# Altium schematic sheet mainboard-schematic.schdoc
size 298 x 132 mm
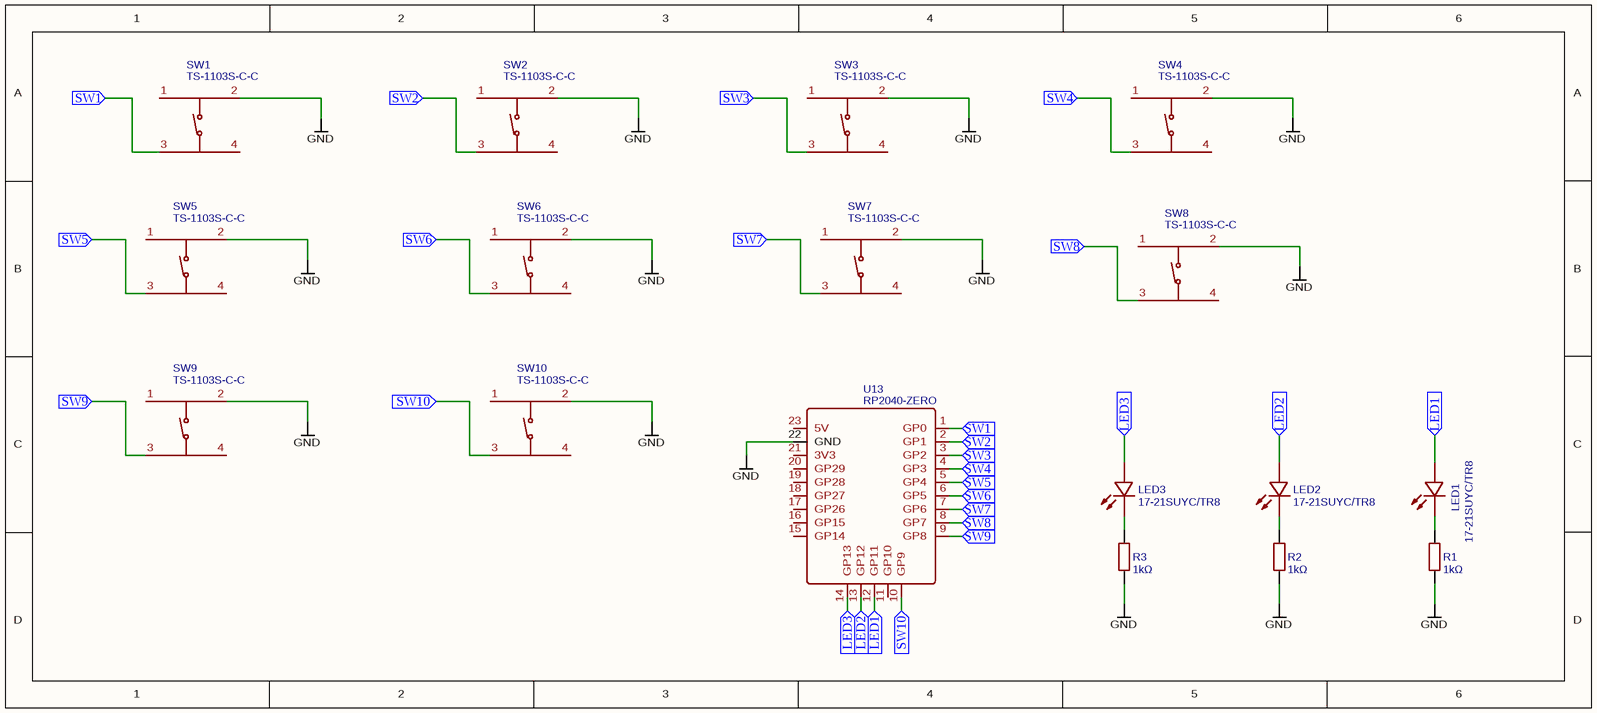
[diagram p0: mainboard-schematic.schdoc]

## Parts
LED1  17-21SUYC/TR8  [LED0805-R-RD]
LED2  17-21SUYC/TR8  [LED0805-R-RD]
LED3  17-21SUYC/TR8  [LED0805-R-RD]
R1  1kΩ  [R1206]
R2  1kΩ  [R1206]
R3  1kΩ  [R1206]
SW1  TS-1103S-C-C  [KEY-SMD_4P-L12.0-W12.0-P5.00-LS15.4]
SW2  TS-1103S-C-C  [KEY-SMD_4P-L12.0-W12.0-P5.00-LS15.4]
SW3  TS-1103S-C-C  [KEY-SMD_4P-L12.0-W12.0-P5.00-LS15.4]
SW4  TS-1103S-C-C  [KEY-SMD_4P-L12.0-W12.0-P5.00-LS15.4]
SW5  TS-1103S-C-C  [KEY-SMD_4P-L12.0-W12.0-P5.00-LS15.4]
SW6  TS-1103S-C-C  [KEY-SMD_4P-L12.0-W12.0-P5.00-LS15.4]
SW7  TS-1103S-C-C  [KEY-SMD_4P-L12.0-W12.0-P5.00-LS15.4]
SW8  TS-1103S-C-C  [KEY-SMD_4P-L12.0-W12.0-P5.00-LS15.4]
SW9  TS-1103S-C-C  [KEY-SMD_4P-L12.0-W12.0-P5.00-LS15.4]
SW10  TS-1103S-C-C  [KEY-SMD_4P-L12.0-W12.0-P5.00-LS15.4]
U13  RP2040-ZERO  [COMM-SMD_RP2040-ZERO]

## Ports
LED1 (in), LED2 (in), LED3 (in), SW1 (in), SW2 (in), SW3 (in), SW4 (in), SW5 (in), SW6 (in), SW7 (in), SW8 (in), SW9 (in), SW10 (in)

## Nets
GND: R1.2 R2.2 R3.2 SW1.2 SW2.2 SW3.2 SW4.2 SW5.2 SW6.2 SW7.2 SW8.2 SW9.2 SW10.2 U13.22(GND)
LED1: LED1.1(+) U13.12(GP11) ; port LED1
LED2: LED2.1(+) U13.13(GP12) ; port LED2
LED3: LED3.1(+) U13.14(GP13) ; port LED3
SW1: SW1.3 U13.1(GP0) ; port SW1
SW2: SW2.3 U13.2(GP1) ; port SW2
SW3: SW3.3 U13.3(GP2) ; port SW3
SW4: SW4.3 U13.4(GP3) ; port SW4
SW5: SW5.3 U13.5(GP4) ; port SW5
SW6: SW6.3 U13.6(GP5) ; port SW6
SW7: SW7.3 U13.7(GP6) ; port SW7
SW8: SW8.3 U13.8(GP7) ; port SW8
SW9: SW9.3 U13.9(GP8) ; port SW9
SW10: SW10.3 U13.10(GP9) ; port SW10
NetLED1_2: LED1.2(-) R1.1
NetLED2_2: LED2.2(-) R2.1
NetLED3_2: LED3.2(-) R3.1

Not connected (* = marked no-connect by the designer): SW1 1 4; SW2 1 4; SW3 1 4; SW4 1 4; SW5 1 4; SW6 1 4; SW7 1 4; SW8 1 4; SW9 1 4; SW10 1 4; U13 11(GP10) 15(GP14) 16(GP15) 17(GP26) 18(GP27) 19(GP28) 20(GP29) 21(3V3) 23(5V)

## Library data of the parts
LED1-LED3 = 17-21SUYC/TR8: Manufacturer: KENTO; Manufacturer Part: KT-0805黄灯; Supplier: LCSC; Supplier Part: C2296; JLCPCB Part Class: Basic Part; spicePre: L; spiceSymbolName: 17-21SUYC/TR8
R1-R3 = 1kΩ: Manufacturer: UNI-ROYAL(厚声); Manufacturer Part: 1206W4F1001T5E; nameAlias: Value; Supplier: LCSC; Supplier Part: C4410; JLCPCB Part Class: Basic Part; spicePre: R; spiceSymbolName: 1206W4F1001T5E
SW1-SW10 = TS-1103S-C-C: Manufacturer: XKB Connectivity(中国星坤); Contributor: LCSC; Supplier: LCSC; Supplier Part: C318916; Manufacturer Part: TS-1103S-C-C; JLCPCB Part Class: Extended Part; spicePre: S; spiceSymbolName: TS-1103S-C-C
U13 = RP2040-ZERO: Manufacturer: Waveshare(微雪电子); Contributor: lcsc; Supplier: LCSC; Supplier Part: C5350143; Manufacturer Part: RP2040-Zero; JLCPCB Part Class: Extended Part; spicePre: U; spiceSymbolName: RP2040-ZERO